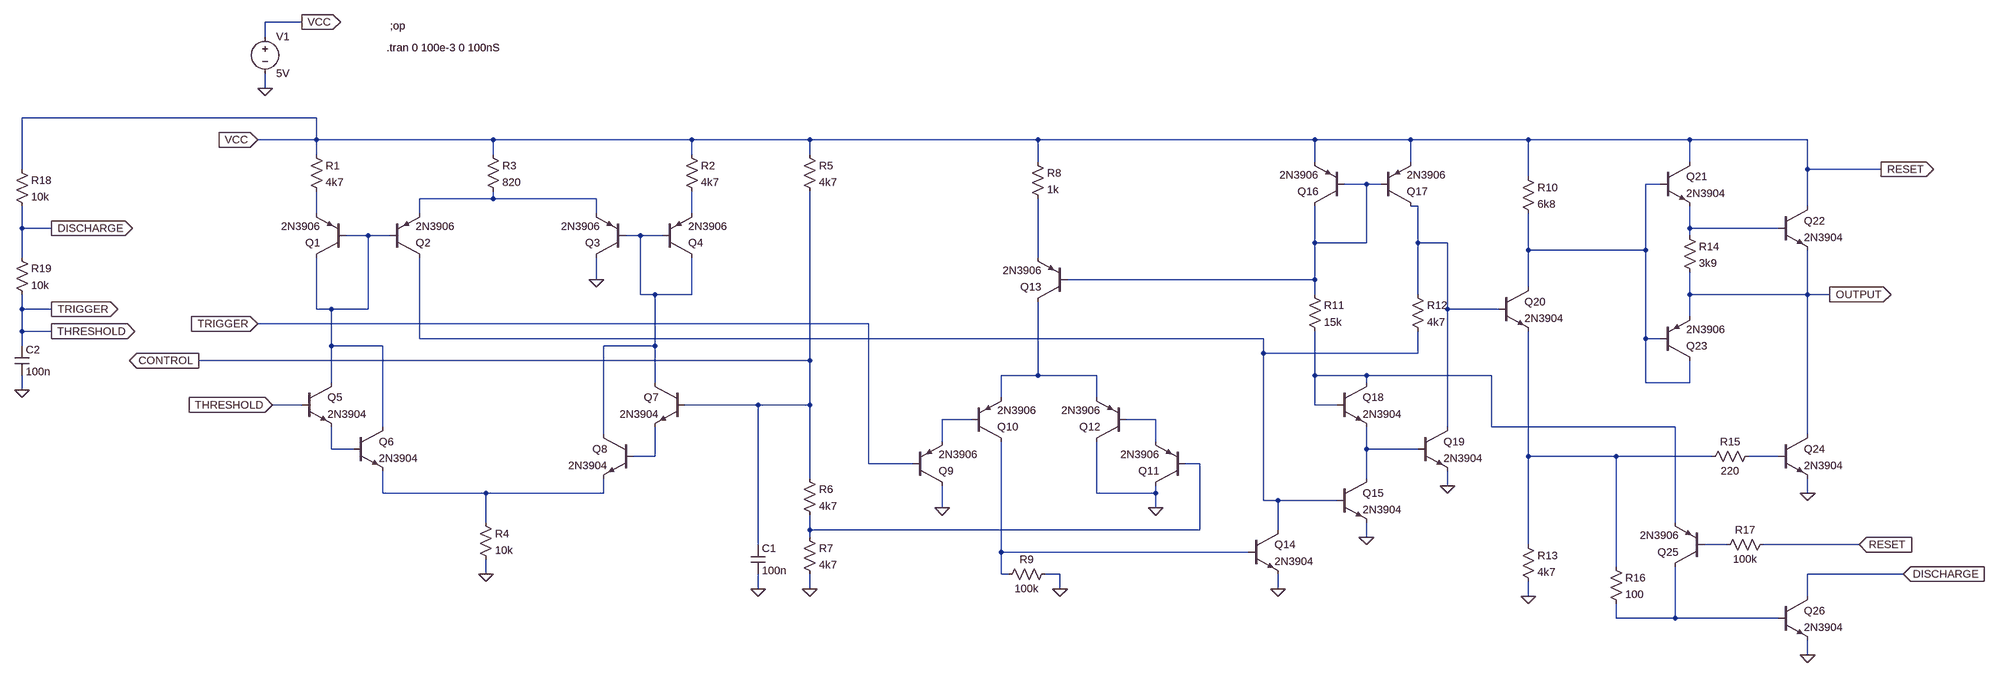
[diagram p0: schematic ems_555_1.asc]
ems_555_1.asc, the LTspice schematic file:
Version 4
SHEET 1 3512 680
WIRE -304 -752 -384 -752
WIRE -384 -720 -384 -752
WIRE -384 -608 -384 -640
WIRE -272 -544 -912 -544
WIRE -272 -496 -272 -544
WIRE -272 -496 -400 -496
WIRE 112 -496 -272 -496
WIRE 544 -496 112 -496
WIRE 800 -496 544 -496
WIRE 1296 -496 800 -496
WIRE 1968 -496 1296 -496
WIRE 2176 -496 1968 -496
WIRE 2432 -496 2176 -496
WIRE 2848 -496 2432 -496
WIRE 3104 -496 2848 -496
WIRE -272 -464 -272 -496
WIRE 112 -464 112 -496
WIRE 544 -464 544 -496
WIRE 800 -464 800 -496
WIRE 1296 -448 1296 -496
WIRE 1968 -448 1968 -496
WIRE 2176 -448 2176 -496
WIRE 2848 -448 2848 -496
WIRE -912 -432 -912 -544
WIRE 3104 -432 3104 -496
WIRE 3264 -432 3104 -432
WIRE 2432 -416 2432 -496
WIRE 2080 -400 2032 -400
WIRE 2112 -400 2080 -400
WIRE 2784 -400 2752 -400
WIRE 112 -368 112 -384
WIRE 112 -368 -48 -368
WIRE 336 -368 112 -368
WIRE 2192 -352 2176 -352
WIRE 3104 -352 3104 -432
WIRE -272 -336 -272 -384
WIRE -48 -336 -48 -368
WIRE 336 -336 336 -368
WIRE 544 -336 544 -384
WIRE -912 -304 -912 -352
WIRE -848 -304 -912 -304
WIRE 2848 -304 2848 -352
WIRE 3040 -304 2848 -304
WIRE -160 -288 -208 -288
WIRE -112 -288 -160 -288
WIRE 432 -288 400 -288
WIRE 480 -288 432 -288
WIRE 2848 -288 2848 -304
WIRE 1968 -272 1968 -352
WIRE 2080 -272 2080 -400
WIRE 2080 -272 1968 -272
WIRE 2192 -272 2192 -352
WIRE 2256 -272 2192 -272
WIRE 2432 -256 2432 -336
WIRE 2752 -256 2752 -400
WIRE 2752 -256 2432 -256
WIRE -912 -240 -912 -304
WIRE 1296 -240 1296 -368
WIRE 336 -192 336 -240
WIRE 1968 -192 1968 -272
WIRE 1968 -192 1360 -192
WIRE 2432 -176 2432 -256
WIRE 432 -160 432 -288
WIRE 464 -160 432 -160
WIRE 544 -160 544 -240
WIRE 544 -160 464 -160
WIRE 1968 -160 1968 -192
WIRE 2192 -160 2192 -272
WIRE 2848 -160 2848 -208
WIRE 3104 -160 3104 -256
WIRE 3104 -160 2848 -160
WIRE 3152 -160 3104 -160
WIRE -912 -128 -912 -160
WIRE -848 -128 -912 -128
WIRE -272 -128 -272 -240
WIRE -240 -128 -272 -128
WIRE -160 -128 -160 -288
WIRE -160 -128 -240 -128
WIRE 2256 -128 2256 -272
WIRE 2368 -128 2256 -128
WIRE 2848 -112 2848 -160
WIRE 928 -96 -400 -96
WIRE -912 -80 -912 -128
WIRE -848 -80 -912 -80
WIRE -48 -64 -48 -240
WIRE 1856 -64 -48 -64
WIRE 2752 -64 2752 -256
WIRE 2784 -64 2752 -64
WIRE -912 -48 -912 -80
WIRE -240 -48 -240 -128
WIRE -128 -48 -240 -48
WIRE 464 -48 464 -160
WIRE 464 -48 352 -48
WIRE 1856 -32 1856 -64
WIRE 2192 -32 2192 -80
WIRE 2192 -32 1856 -32
WIRE 800 -16 800 -384
WIRE 800 -16 -528 -16
WIRE 1296 16 1296 -144
WIRE 1296 16 1216 16
WIRE 1424 16 1296 16
WIRE 1968 16 1968 -80
WIRE 2080 16 1968 16
WIRE 2352 16 2080 16
WIRE -240 32 -240 -48
WIRE 464 32 464 -48
WIRE 2080 32 2080 16
WIRE 2752 32 2752 -64
WIRE 2848 32 2848 -16
WIRE 2848 32 2752 32
WIRE -912 48 -912 16
WIRE 1216 64 1216 16
WIRE 1424 64 1424 16
WIRE -304 80 -368 80
WIRE 688 80 528 80
WIRE 800 80 800 -16
WIRE 800 80 688 80
WIRE 1968 80 1968 16
WIRE 2016 80 1968 80
WIRE 1152 112 1088 112
WIRE 1552 112 1488 112
WIRE -128 128 -128 -48
WIRE 2256 128 2256 -128
WIRE 2352 128 2352 16
WIRE 2816 128 2352 128
WIRE 352 144 352 -48
WIRE 3104 144 3104 -160
WIRE 1088 160 1088 112
WIRE 1552 160 1552 112
WIRE -240 176 -240 128
WIRE -192 176 -240 176
WIRE 2080 176 2080 128
WIRE 2192 176 2080 176
WIRE 464 192 464 128
WIRE 464 192 416 192
WIRE 2432 192 2432 -80
WIRE 2688 192 2432 192
WIRE 2896 192 2688 192
WIRE 3040 192 2976 192
WIRE 928 208 928 -96
WIRE 1024 208 928 208
WIRE 1648 208 1616 208
WIRE 800 240 800 80
WIRE 2080 240 2080 176
WIRE 2256 256 2256 224
WIRE -128 272 -128 224
WIRE 96 272 -128 272
WIRE 352 272 352 240
WIRE 352 272 96 272
WIRE 1424 272 1424 160
WIRE 1552 272 1552 256
WIRE 1552 272 1424 272
WIRE 3104 272 3104 240
WIRE 1856 288 1856 -32
WIRE 1888 288 1856 288
WIRE 2016 288 1888 288
WIRE 1088 304 1088 256
WIRE 1552 304 1552 272
WIRE 96 336 96 272
WIRE 2816 336 2816 128
WIRE 800 352 800 320
WIRE 1648 352 1648 208
WIRE 1648 352 800 352
WIRE 1888 352 1888 288
WIRE 800 368 800 352
WIRE 2080 368 2080 336
WIRE 688 384 688 80
WIRE 2432 384 2432 192
WIRE 2928 384 2880 384
WIRE 3216 384 3008 384
WIRE 1216 400 1216 160
WIRE 1824 400 1216 400
WIRE 2688 432 2688 192
WIRE 96 448 96 416
WIRE 1216 448 1216 400
WIRE 1232 448 1216 448
WIRE 1344 448 1312 448
WIRE 3312 448 3104 448
WIRE 688 480 688 448
WIRE 800 480 800 448
WIRE 1344 480 1344 448
WIRE 1888 480 1888 448
WIRE 2432 496 2432 464
WIRE 3104 496 3104 448
WIRE 2688 544 2688 512
WIRE 2816 544 2816 432
WIRE 2816 544 2688 544
WIRE 3040 544 2816 544
WIRE 3104 624 3104 592
FLAG 336 -192 0
FLAG 96 448 0
FLAG 800 480 0
FLAG 688 480 0
FLAG 1088 304 0
FLAG 1552 304 0
FLAG 1344 480 0
FLAG 1888 480 0
FLAG 2080 368 0
FLAG 2256 256 0
FLAG 2432 496 0
FLAG 3104 272 0
FLAG 3104 624 0
FLAG 3216 384 RESET
IOPIN 3216 384 In
FLAG 3312 448 DISCHARGE
IOPIN 3312 448 In
FLAG 3152 -160 OUTPUT
IOPIN 3152 -160 Out
FLAG -400 -496 VCC
IOPIN -400 -496 In
FLAG -368 80 THRESHOLD
IOPIN -368 80 In
FLAG -528 -16 CONTROL
IOPIN -528 -16 Out
FLAG -400 -96 TRIGGER
IOPIN -400 -96 In
FLAG -384 -608 0
FLAG -304 -752 VCC
IOPIN -304 -752 Out
FLAG -912 48 0
FLAG -848 -304 DISCHARGE
IOPIN -848 -304 Out
FLAG -848 -128 TRIGGER
IOPIN -848 -128 Out
FLAG -848 -80 THRESHOLD
IOPIN -848 -80 Out
FLAG 3264 -432 RESET
IOPIN 3264 -432 Out
SYMBOL pnp -208 -240 R180
SYMATTR InstName Q1
SYMATTR Value 2N3906
SYMBOL pnp -112 -240 M180
SYMATTR InstName Q2
SYMATTR Value 2N3906
SYMBOL pnp 400 -240 R180
SYMATTR InstName Q3
SYMATTR Value 2N3906
SYMBOL pnp 480 -240 M180
SYMATTR InstName Q4
SYMATTR Value 2N3906
SYMBOL res -288 -480 R0
SYMATTR InstName R1
SYMATTR Value 4k7
SYMBOL res 528 -480 R0
SYMATTR InstName R2
SYMATTR Value 4k7
SYMBOL res 96 -480 R0
SYMATTR InstName R3
SYMATTR Value 820
SYMBOL npn -304 32 R0
SYMATTR InstName Q5
SYMATTR Value 2N3904
SYMBOL npn -192 128 R0
SYMATTR InstName Q6
SYMATTR Value 2N3904
SYMBOL npn 528 32 M0
SYMATTR InstName Q7
SYMATTR Value 2N3904
SYMBOL npn 416 144 M0
SYMATTR InstName Q8
SYMATTR Value 2N3904
SYMBOL res 80 320 R0
SYMATTR InstName R4
SYMATTR Value 10k
SYMBOL res 784 -480 R0
SYMATTR InstName R5
SYMATTR Value 4k7
SYMBOL res 784 224 R0
SYMATTR InstName R6
SYMATTR Value 4k7
SYMBOL res 784 352 R0
SYMATTR InstName R7
SYMATTR Value 4k7
SYMBOL cap 672 384 R0
SYMATTR InstName C1
SYMATTR Value 100n
SYMBOL pnp 1024 256 M180
SYMATTR InstName Q9
SYMATTR Value 2N3906
SYMBOL pnp 1152 160 M180
SYMATTR InstName Q10
SYMATTR Value 2N3906
SYMBOL pnp 1616 256 R180
SYMATTR InstName Q11
SYMATTR Value 2N3906
SYMBOL pnp 1488 160 R180
SYMATTR InstName Q12
SYMATTR Value 2N3906
SYMBOL pnp 1360 -144 R180
SYMATTR InstName Q13
SYMATTR Value 2N3906
SYMBOL res 1280 -464 R0
SYMATTR InstName R8
SYMATTR Value 1k
SYMBOL res 1328 432 R90
WINDOW 0 0 56 VBottom 2
WINDOW 3 32 56 VTop 2
SYMATTR InstName R9
SYMATTR Value 100k
SYMBOL npn 1824 352 R0
SYMATTR InstName Q14
SYMATTR Value 2N3904
SYMBOL npn 2016 240 R0
SYMATTR InstName Q15
SYMATTR Value 2N3904
SYMBOL pnp 2032 -352 R180
SYMATTR InstName Q16
SYMATTR Value 2N3906
SYMBOL pnp 2112 -352 M180
SYMATTR InstName Q17
SYMATTR Value 2N3906
SYMBOL npn 2016 32 R0
SYMATTR InstName Q18
SYMATTR Value 2N3904
SYMBOL res 1952 -176 R0
SYMATTR InstName R11
SYMATTR Value 15k
SYMBOL res 2176 -176 R0
SYMATTR InstName R12
SYMATTR Value 4k7
SYMBOL npn 2192 128 R0
SYMATTR InstName Q19
SYMATTR Value 2N3904
SYMBOL npn 2368 -176 R0
SYMATTR InstName Q20
SYMATTR Value 2N3904
SYMBOL res 2416 -432 R0
SYMATTR InstName R10
SYMATTR Value 6k8
SYMBOL res 2416 368 R0
SYMATTR InstName R13
SYMATTR Value 4k7
SYMBOL npn 2784 -448 R0
SYMATTR InstName Q21
SYMATTR Value 2N3904
SYMBOL npn 3040 -352 R0
SYMATTR InstName Q22
SYMATTR Value 2N3904
SYMBOL res 2832 -304 R0
SYMATTR InstName R14
SYMATTR Value 3k9
SYMBOL pnp 2784 -16 M180
SYMATTR InstName Q23
SYMATTR Value 2N3906
SYMBOL npn 3040 144 R0
SYMATTR InstName Q24
SYMATTR Value 2N3904
SYMBOL res 2992 176 R90
WINDOW 0 0 56 VBottom 2
WINDOW 3 32 56 VTop 2
SYMATTR InstName R15
SYMATTR Value 220
SYMBOL pnp 2880 432 R180
SYMATTR InstName Q25
SYMATTR Value 2N3906
SYMBOL npn 3040 496 R0
SYMATTR InstName Q26
SYMATTR Value 2N3904
SYMBOL res 2672 416 R0
SYMATTR InstName R16
SYMATTR Value 100
SYMBOL res 2912 400 R270
WINDOW 0 32 56 VTop 2
WINDOW 3 0 56 VBottom 2
SYMATTR InstName R17
SYMATTR Value 100k
SYMBOL voltage -384 -736 R0
WINDOW 123 0 0 Left 0
WINDOW 39 0 0 Left 0
SYMATTR InstName V1
SYMATTR Value 5V
SYMBOL res -928 -448 R0
SYMATTR InstName R18
SYMATTR Value 10k
SYMBOL res -928 -256 R0
SYMATTR InstName R19
SYMATTR Value 10k
SYMBOL cap -928 -48 R0
SYMATTR InstName C2
SYMATTR Value 100n
TEXT -112 -744 Left 2 !;op
TEXT -120 -696 Left 2 !.tran 0 100e-3 0 100nS

The netlist it stands for:
* ems_555_1.asc
Q1 N008 N008 N005 0 2N3906
Q2 N011 N008 N003 0 2N3906
Q3 0 N009 N003 0 2N3906
Q4 N009 N009 N006 0 2N3906
R1 VCC N005 4k7
R2 VCC N006 4k7
R3 VCC N003 820
Q5 N008 TRIGGER N016 0 2N3904
Q6 N008 N016 N022 0 2N3904
Q7 N009 CONTROL N018 0 2N3904
Q8 N009 N018 N022 0 2N3904
R4 N022 0 10k
R5 VCC CONTROL 4k7
R6 CONTROL N021 4k7
R7 N021 0 4k7
C1 CONTROL 0 100n
Q9 0 TRIGGER N014 0 2N3906
Q10 N024 N014 N012 0 2N3906
Q11 0 N021 N015 0 2N3906
Q12 0 N015 N012 0 2N3906
Q13 N012 N001 N010 0 2N3906
R8 VCC N010 1k
R9 0 N024 100k
Q14 N011 N024 0 0 2N3904
Q15 N017 N011 0 0 2N3904
Q16 N001 N001 VCC 0 2N3906
Q17 N004 N001 VCC 0 2N3906
Q18 N013 N013 N017 0 2N3904
R11 N001 N013 15k
R12 N004 N011 4k7
Q19 N004 N017 0 0 2N3904
Q20 N002 N004 N019 0 2N3904
R10 VCC N002 6k8
R13 N019 0 4k7
Q21 VCC N002 N007 0 2N3904
Q22 VCC N007 OUTPUT 0 2N3904
R14 N007 OUTPUT 3k9
Q23 N002 N002 OUTPUT 0 2N3906
Q24 OUTPUT N020 0 0 2N3904
R15 N020 N019 220
Q25 N025 N023 N013 0 2N3906
Q26 DISCHARGE N025 0 0 2N3904
R16 N019 N025 100
R17 N023 VCC 100k
V1 VCC 0 5V
R18 VCC DISCHARGE 10k
R19 DISCHARGE TRIGGER 10k
C2 TRIGGER 0 100n
.model NPN NPN
.model PNP PNP
.lib standard.bjt
;op
.tran 0 100e-3 0 100nS
.backanno
.end